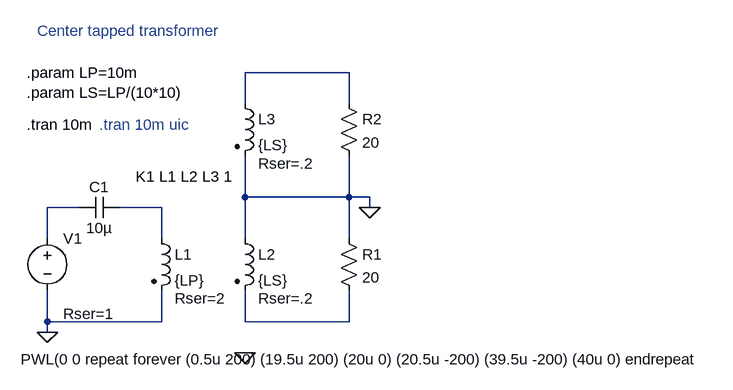
[diagram p0: schematic pulse_trafo2.asc]
pulse_trafo2.asc, the LTspice schematic file:
Version 4
SHEET 1 1360 680
WIRE 592 -160 432 -160
WIRE 432 -112 432 -160
WIRE 592 -112 592 -160
WIRE 432 32 432 -32
WIRE 592 32 592 -32
WIRE 592 32 432 32
WIRE 624 32 592 32
WIRE 176 48 128 48
WIRE 304 48 240 48
WIRE 624 48 624 32
WIRE 128 96 128 48
WIRE 304 96 304 48
WIRE 432 96 432 32
WIRE 592 96 592 32
WIRE 128 224 128 176
WIRE 304 224 304 176
WIRE 304 224 128 224
WIRE 432 224 432 176
WIRE 592 224 592 176
WIRE 592 224 432 224
WIRE 128 240 128 224
FLAG 128 240 0
FLAG 432 272 0
FLAG 624 48 0
SYMBOL voltage 128 80 R0
WINDOW 3 -41 202 Left 0
WINDOW 123 0 0 Left 0
WINDOW 39 24 132 Left 0
SYMATTR Value PWL(0 0 repeat forever (0.5u 200) (19.5u 200) (20u 0) (20.5u -200) (39.5u -200) (40u 0) endrepeat
SYMATTR SpiceLine Rser=1
SYMATTR InstName V1
SYMBOL ind2 288 80 R0
WINDOW 39 36 108 Left 0
SYMATTR SpiceLine Rser=2
SYMATTR InstName L1
SYMATTR Value {LP}
SYMATTR Type ind
SYMBOL ind2 416 80 R0
WINDOW 39 36 108 Left 0
SYMATTR SpiceLine Rser=.2
SYMATTR InstName L2
SYMATTR Value {LS}
SYMATTR Type ind
SYMBOL res 576 80 R0
SYMATTR InstName R1
SYMATTR Value 20
SYMBOL cap 176 64 R270
WINDOW 0 32 32 VTop 0
WINDOW 3 0 32 VBottom 0
SYMATTR InstName C1
SYMATTR Value 10µ
SYMBOL ind2 416 -128 R0
WINDOW 39 36 108 Left 0
SYMATTR SpiceLine Rser=.2
SYMATTR InstName L3
SYMATTR Value {LS}
SYMATTR Type ind
SYMBOL res 576 -128 R0
SYMATTR InstName R2
SYMATTR Value 20
TEXT 96 -160 Left 0 !.param LP=10m\n.param LS=LP/(10*10)
TEXT 96 -80 Left 0 !.tran 10m
TEXT 264 0 Left 0 !K1 L1 L2 L3 1
TEXT 208 -80 Left 0 ;.tran 10m uic
TEXT 112 -224 Left 0 ;Center tapped transformer

The netlist it stands for:
* pulse_trafo2.asc
V1 N002 0 PWL(0 0 repeat forever (0.5u 200) (19.5u 200) (20u 0) (20.5u -200) (39.5u -200) (40u 0) endrepeat Rser=1
L1 N003 0 {LP} Rser=2
L2 0 N004 {LS} Rser=.2
R1 0 N004 20
C1 N002 N003 10µ
L3 N001 0 {LS} Rser=.2
R2 N001 0 20
.param LP=10m
.param LS=LP/(10*10)
.tran 10m
K1 L1 L2 L3 1
* .tran 10m uic
* Center tapped transformer
.backanno
.end